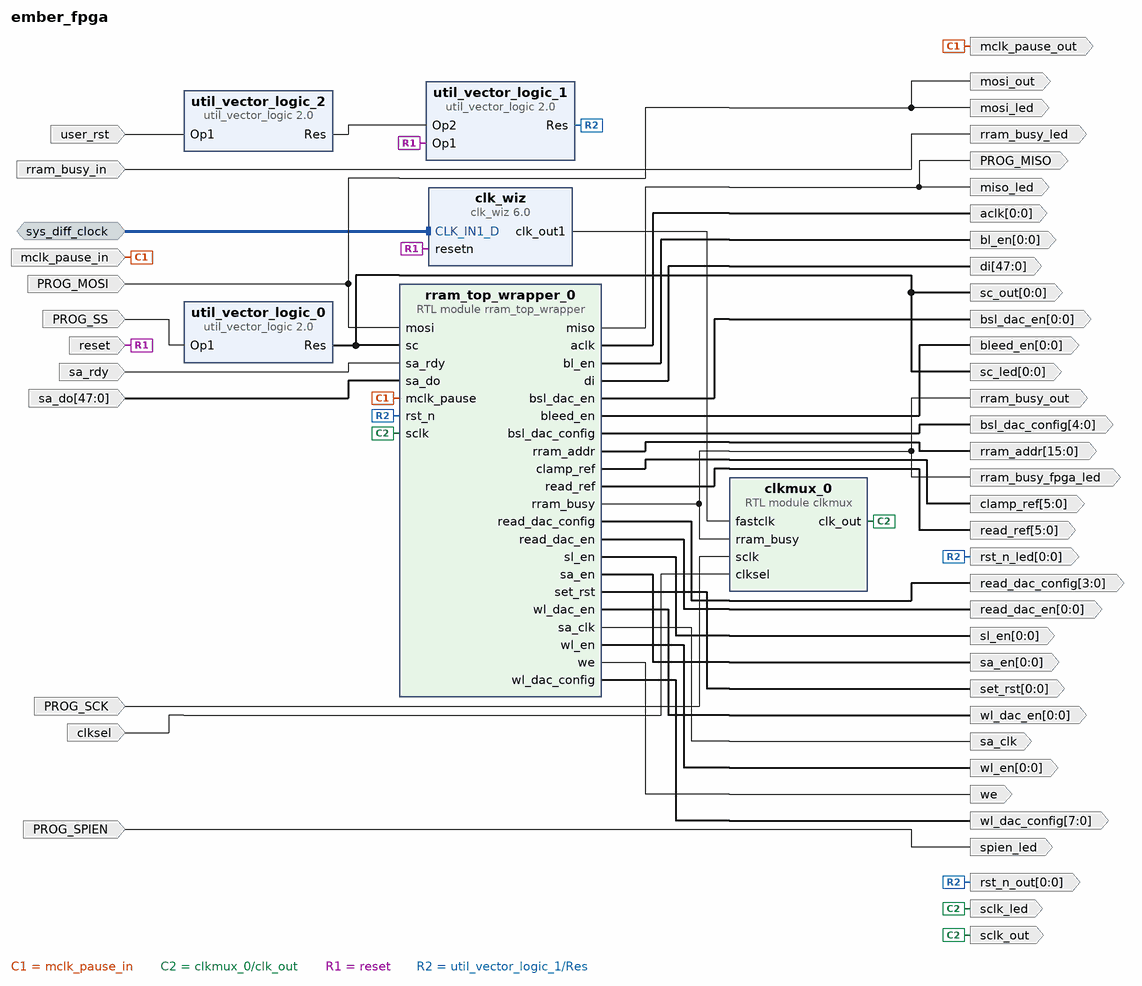
[diagram p0: block diagram of the top level]
# Vivado block design ember_fpga, xc7k325tffg900-2, Vivado 2020.2
create_bd_design ember_fpga

create_bd_intf_port -mode Slave -vlnv xilinx.com:interface:diff_clock_rtl:1.0 sys_diff_clock
set_property -dict {CONFIG.FREQ_HZ 200000000} [get_bd_intf_ports sys_diff_clock]
create_bd_port -dir I PROG_SS
create_bd_port -dir I PROG_MOSI
create_bd_port -dir O sclk_led
create_bd_port -dir O -from 0 -to 0 sc_led
create_bd_port -dir O mosi_led
create_bd_port -dir I -from 47 -to 0 sa_do
create_bd_port -dir O mosi_out
create_bd_port -dir O -from 0 -to 0 sc_out
create_bd_port -dir O sclk_out
create_bd_port -dir O mclk_pause_out
create_bd_port -dir I rram_busy_in
create_bd_port -dir O rram_busy_led
create_bd_port -dir O rram_busy_out
create_bd_port -dir I -type clk PROG_SCK
set_property -dict {CONFIG.FREQ_HZ 33000000} [get_bd_ports PROG_SCK]
create_bd_port -dir I sa_rdy
create_bd_port -dir O PROG_MISO
create_bd_port -dir O rram_busy_fpga_led
create_bd_port -dir O miso_led
create_bd_port -dir I mclk_pause_in
create_bd_port -dir I PROG_SPIEN
create_bd_port -dir O spien_led
create_bd_port -dir O -from 0 -to 0 rst_n_out
create_bd_port -dir I -type rst reset
set_property -dict {CONFIG.POLARITY ACTIVE_LOW} [get_bd_ports reset]
create_bd_port -dir I clksel
create_bd_port -dir O -from 0 -to 0 rst_n_led
create_bd_port -dir O -from 0 -to 0 aclk
create_bd_port -dir O -from 0 -to 0 bl_en
create_bd_port -dir O -from 0 -to 0 wl_en
create_bd_port -dir O -from 0 -to 0 sl_en
create_bd_port -dir O -from 0 -to 0 read_dac_en
create_bd_port -dir O -from 0 -to 0 bleed_en
create_bd_port -dir O -from 5 -to 0 clamp_ref
create_bd_port -dir O -from 47 -to 0 di
create_bd_port -dir O -from 3 -to 0 read_dac_config
create_bd_port -dir O -from 5 -to 0 read_ref
create_bd_port -dir O -from 15 -to 0 rram_addr
create_bd_port -dir O sa_clk
create_bd_port -dir O -from 0 -to 0 sa_en
create_bd_port -dir O -from 0 -to 0 set_rst
create_bd_port -dir O -from 0 -to 0 wl_dac_en
create_bd_port -dir O -from 0 -to 0 bsl_dac_en
create_bd_port -dir O -from 4 -to 0 bsl_dac_config
create_bd_port -dir O we
create_bd_port -dir O -from 7 -to 0 wl_dac_config
create_bd_port -dir I -type rst user_rst
set_property -dict {CONFIG.POLARITY ACTIVE_HIGH} [get_bd_ports user_rst]

create_bd_cell -type ip -vlnv xilinx.com:ip:clk_wiz:6.0 clk_wiz
set_property -dict [list \
  CONFIG.AXI_DRP false \
  CONFIG.CLKFB_IN_SIGNALING SINGLE \
  CONFIG.CLKIN1_JITTER_PS 50 \
  CONFIG.CLKIN1_UI_JITTER 50 \
  CONFIG.CLKIN2_JITTER_PS 100.000 \
  CONFIG.CLKIN2_UI_JITTER 100.000 \
  CONFIG.CLKOUT1_DRIVES BUFG \
  CONFIG.CLKOUT1_JITTER 112.316 \
  CONFIG.CLKOUT1_PHASE_ERROR 89.971 \
  CONFIG.CLKOUT1_REQUESTED_OUT_FREQ 100 \
  CONFIG.CLKOUT1_USED true \
  CONFIG.CLKOUT2_DRIVES BUFG \
  CONFIG.CLKOUT2_JITTER 129.198 \
  CONFIG.CLKOUT2_PHASE_ERROR 89.971 \
  CONFIG.CLKOUT2_REQUESTED_DUTY_CYCLE 80 \
  CONFIG.CLKOUT2_REQUESTED_OUT_FREQ 50 \
  CONFIG.CLKOUT2_REQUESTED_PHASE -54 \
  CONFIG.CLKOUT2_USED false \
  CONFIG.CLKOUT3_DRIVES BUFG \
  CONFIG.CLKOUT3_JITTER 129.198 \
  CONFIG.CLKOUT3_PHASE_ERROR 89.971 \
  CONFIG.CLKOUT3_REQUESTED_OUT_FREQ 50.000 \
  CONFIG.CLKOUT3_REQUESTED_PHASE 180 \
  CONFIG.CLKOUT3_USED false \
  CONFIG.CLKOUT4_DRIVES BUFG \
  CONFIG.CLKOUT4_REQUESTED_OUT_FREQ 100.000 \
  CONFIG.CLKOUT5_DRIVES BUFG \
  CONFIG.CLKOUT5_REQUESTED_OUT_FREQ 100.000 \
  CONFIG.CLKOUT6_DRIVES BUFG \
  CONFIG.CLKOUT6_REQUESTED_OUT_FREQ 100.000 \
  CONFIG.CLKOUT7_DRIVES BUFG \
  CONFIG.CLKOUT7_REQUESTED_OUT_FREQ 100.000 \
  CONFIG.CLK_IN1_BOARD_INTERFACE Custom \
  CONFIG.ENABLE_CLOCK_MONITOR false \
  CONFIG.FEEDBACK_SOURCE FDBK_AUTO \
  CONFIG.INTERFACE_SELECTION Enable_AXI \
  CONFIG.JITTER_OPTIONS PS \
  CONFIG.MMCM_BANDWIDTH OPTIMIZED \
  CONFIG.MMCM_CLKFBOUT_MULT_F 5.000 \
  CONFIG.MMCM_CLKIN1_PERIOD 5.000 \
  CONFIG.MMCM_CLKIN2_PERIOD 10.0 \
  CONFIG.MMCM_CLKOUT0_DIVIDE_F 10.000 \
  CONFIG.MMCM_CLKOUT1_DIVIDE 1 \
  CONFIG.MMCM_CLKOUT1_DUTY_CYCLE 0.800 \
  CONFIG.MMCM_CLKOUT1_PHASE -54.000 \
  CONFIG.MMCM_CLKOUT2_DIVIDE 1 \
  CONFIG.MMCM_CLKOUT2_PHASE 180.000 \
  CONFIG.MMCM_COMPENSATION ZHOLD \
  CONFIG.MMCM_DIVCLK_DIVIDE 1 \
  CONFIG.MMCM_REF_JITTER2 0.010 \
  CONFIG.NUM_OUT_CLKS 1 \
  CONFIG.PHASE_DUTY_CONFIG false \
  CONFIG.PRIMITIVE MMCM \
  CONFIG.PRIM_SOURCE Differential_clock_capable_pin \
  CONFIG.RESET_BOARD_INTERFACE reset \
  CONFIG.RESET_PORT resetn \
  CONFIG.RESET_TYPE ACTIVE_LOW \
  CONFIG.SECONDARY_IN_FREQ 100.000 \
  CONFIG.SECONDARY_SOURCE Single_ended_clock_capable_pin \
  CONFIG.USE_BOARD_FLOW true \
  CONFIG.USE_DYN_RECONFIG false \
  CONFIG.USE_FREQ_SYNTH true \
  CONFIG.USE_INCLK_SWITCHOVER false \
  CONFIG.USE_LOCKED false \
  CONFIG.USE_PHASE_ALIGNMENT true \
  CONFIG.USE_RESET true \
] [get_bd_cells clk_wiz]
create_bd_cell -type ip -vlnv xilinx.com:ip:util_vector_logic:2.0 util_vector_logic_0
set_property -dict {CONFIG.C_OPERATION not CONFIG.C_SIZE 1} [get_bd_cells util_vector_logic_0]
create_bd_cell -type module -reference clkmux clkmux_0
create_bd_cell -type ip -vlnv xilinx.com:ip:util_vector_logic:2.0 util_vector_logic_1
set_property -dict {CONFIG.C_OPERATION and CONFIG.C_SIZE 1} [get_bd_cells util_vector_logic_1]
create_bd_cell -type ip -vlnv xilinx.com:ip:util_vector_logic:2.0 util_vector_logic_2
set_property -dict {CONFIG.C_OPERATION not CONFIG.C_SIZE 1} [get_bd_cells util_vector_logic_2]
create_bd_cell -type module -reference rram_top_wrapper rram_top_wrapper_0

# ---- connections ----

connect_bd_intf_net [get_bd_intf_ports sys_diff_clock] [get_bd_intf_pins clk_wiz/CLK_IN1_D]
connect_bd_net -net mosi_in [get_bd_ports PROG_MOSI] [get_bd_ports mosi_led] [get_bd_ports mosi_out] [get_bd_pins rram_top_wrapper_0/mosi]
connect_bd_net -net sc_in [get_bd_pins util_vector_logic_0/Res] [get_bd_ports sc_led] [get_bd_ports sc_out] [get_bd_pins rram_top_wrapper_0/sc]
connect_bd_net [get_bd_ports mclk_pause_in] [get_bd_ports mclk_pause_out] [get_bd_pins rram_top_wrapper_0/mclk_pause]
connect_bd_net -net rram_busy [get_bd_ports rram_busy_in] [get_bd_ports rram_busy_led]
connect_bd_net -net clkmux_0_sclk_out [get_bd_pins clkmux_0/clk_out] \
  [get_bd_ports sclk_out] [get_bd_ports sclk_led] [get_bd_pins rram_top_wrapper_0/sclk]
connect_bd_net -net sclk_in_1 [get_bd_ports PROG_SCK] [get_bd_pins clkmux_0/sclk]
connect_bd_net [get_bd_ports sa_rdy] [get_bd_pins rram_top_wrapper_0/sa_rdy]
connect_bd_net [get_bd_ports sa_do] [get_bd_pins rram_top_wrapper_0/sa_do]
connect_bd_net [get_bd_pins rram_top_wrapper_0/miso] [get_bd_ports PROG_MISO] [get_bd_ports miso_led]
connect_bd_net [get_bd_pins rram_top_wrapper_0/rram_busy] \
  [get_bd_ports rram_busy_fpga_led] [get_bd_ports rram_busy_out] [get_bd_pins clkmux_0/rram_busy]
connect_bd_net -net clk [get_bd_pins clk_wiz/clk_out1] [get_bd_pins clkmux_0/fastclk]
connect_bd_net [get_bd_ports PROG_SPIEN] [get_bd_ports spien_led]
connect_bd_net [get_bd_ports clksel] [get_bd_pins clkmux_0/clksel]
connect_bd_net [get_bd_ports PROG_SS] [get_bd_pins util_vector_logic_0/Op1]
connect_bd_net -net rram_addr [get_bd_pins rram_top_wrapper_0/rram_addr] [get_bd_ports rram_addr]
connect_bd_net -net di [get_bd_pins rram_top_wrapper_0/di] [get_bd_ports di]
connect_bd_net -net read_ref [get_bd_pins rram_top_wrapper_0/read_ref] [get_bd_ports read_ref]
connect_bd_net [get_bd_pins rram_top_wrapper_0/aclk] [get_bd_ports aclk]
connect_bd_net [get_bd_pins rram_top_wrapper_0/bsl_dac_en] [get_bd_ports bsl_dac_en]
connect_bd_net [get_bd_pins rram_top_wrapper_0/bl_en] [get_bd_ports bl_en]
connect_bd_net [get_bd_pins rram_top_wrapper_0/sl_en] [get_bd_ports sl_en]
connect_bd_net [get_bd_pins rram_top_wrapper_0/bleed_en] [get_bd_ports bleed_en]
connect_bd_net [get_bd_pins rram_top_wrapper_0/set_rst] [get_bd_ports set_rst]
connect_bd_net [get_bd_pins rram_top_wrapper_0/read_dac_config] [get_bd_ports read_dac_config]
connect_bd_net [get_bd_pins rram_top_wrapper_0/wl_en] [get_bd_ports wl_en]
connect_bd_net [get_bd_pins rram_top_wrapper_0/wl_dac_en] [get_bd_ports wl_dac_en]
connect_bd_net [get_bd_pins rram_top_wrapper_0/read_dac_en] [get_bd_ports read_dac_en]
connect_bd_net [get_bd_pins rram_top_wrapper_0/bsl_dac_config] [get_bd_ports bsl_dac_config]
connect_bd_net [get_bd_pins rram_top_wrapper_0/clamp_ref] [get_bd_ports clamp_ref]
connect_bd_net [get_bd_pins rram_top_wrapper_0/sa_en] [get_bd_ports sa_en]
connect_bd_net [get_bd_pins rram_top_wrapper_0/we] [get_bd_ports we]
connect_bd_net [get_bd_pins rram_top_wrapper_0/wl_dac_config] [get_bd_ports wl_dac_config]
connect_bd_net [get_bd_pins rram_top_wrapper_0/sa_clk] [get_bd_ports sa_clk]
connect_bd_net [get_bd_ports reset] [get_bd_pins clk_wiz/resetn] [get_bd_pins util_vector_logic_1/Op1]
connect_bd_net [get_bd_pins util_vector_logic_1/Res] [get_bd_ports rst_n_led] [get_bd_ports rst_n_out] [get_bd_pins rram_top_wrapper_0/rst_n]
connect_bd_net [get_bd_ports user_rst] [get_bd_pins util_vector_logic_2/Op1]
connect_bd_net [get_bd_pins util_vector_logic_2/Res] [get_bd_pins util_vector_logic_1/Op2]

validate_bd_design
save_bd_design
